# Altium schematic sheet Power.SchDoc
size A4; SheetNumber: 1; SheetTotal: 3
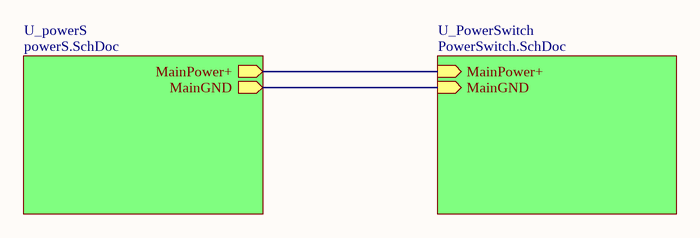
[diagram p0: Power.SchDoc]

## Sub-sheets
U_powerS = powerS.SchDoc: MainPower+ (out), MainGND (out)
U_PowerSwitch = PowerSwitch.SchDoc: MainPower+ (in), MainGND (in)

## Nets
(unnamed): sheet U_powerS/MainPower+, sheet U_PowerSwitch/MainPower+
(unnamed): sheet U_powerS/MainGND, sheet U_PowerSwitch/MainGND